# Altium schematic sheet Conn_B.SchDoc
size A1
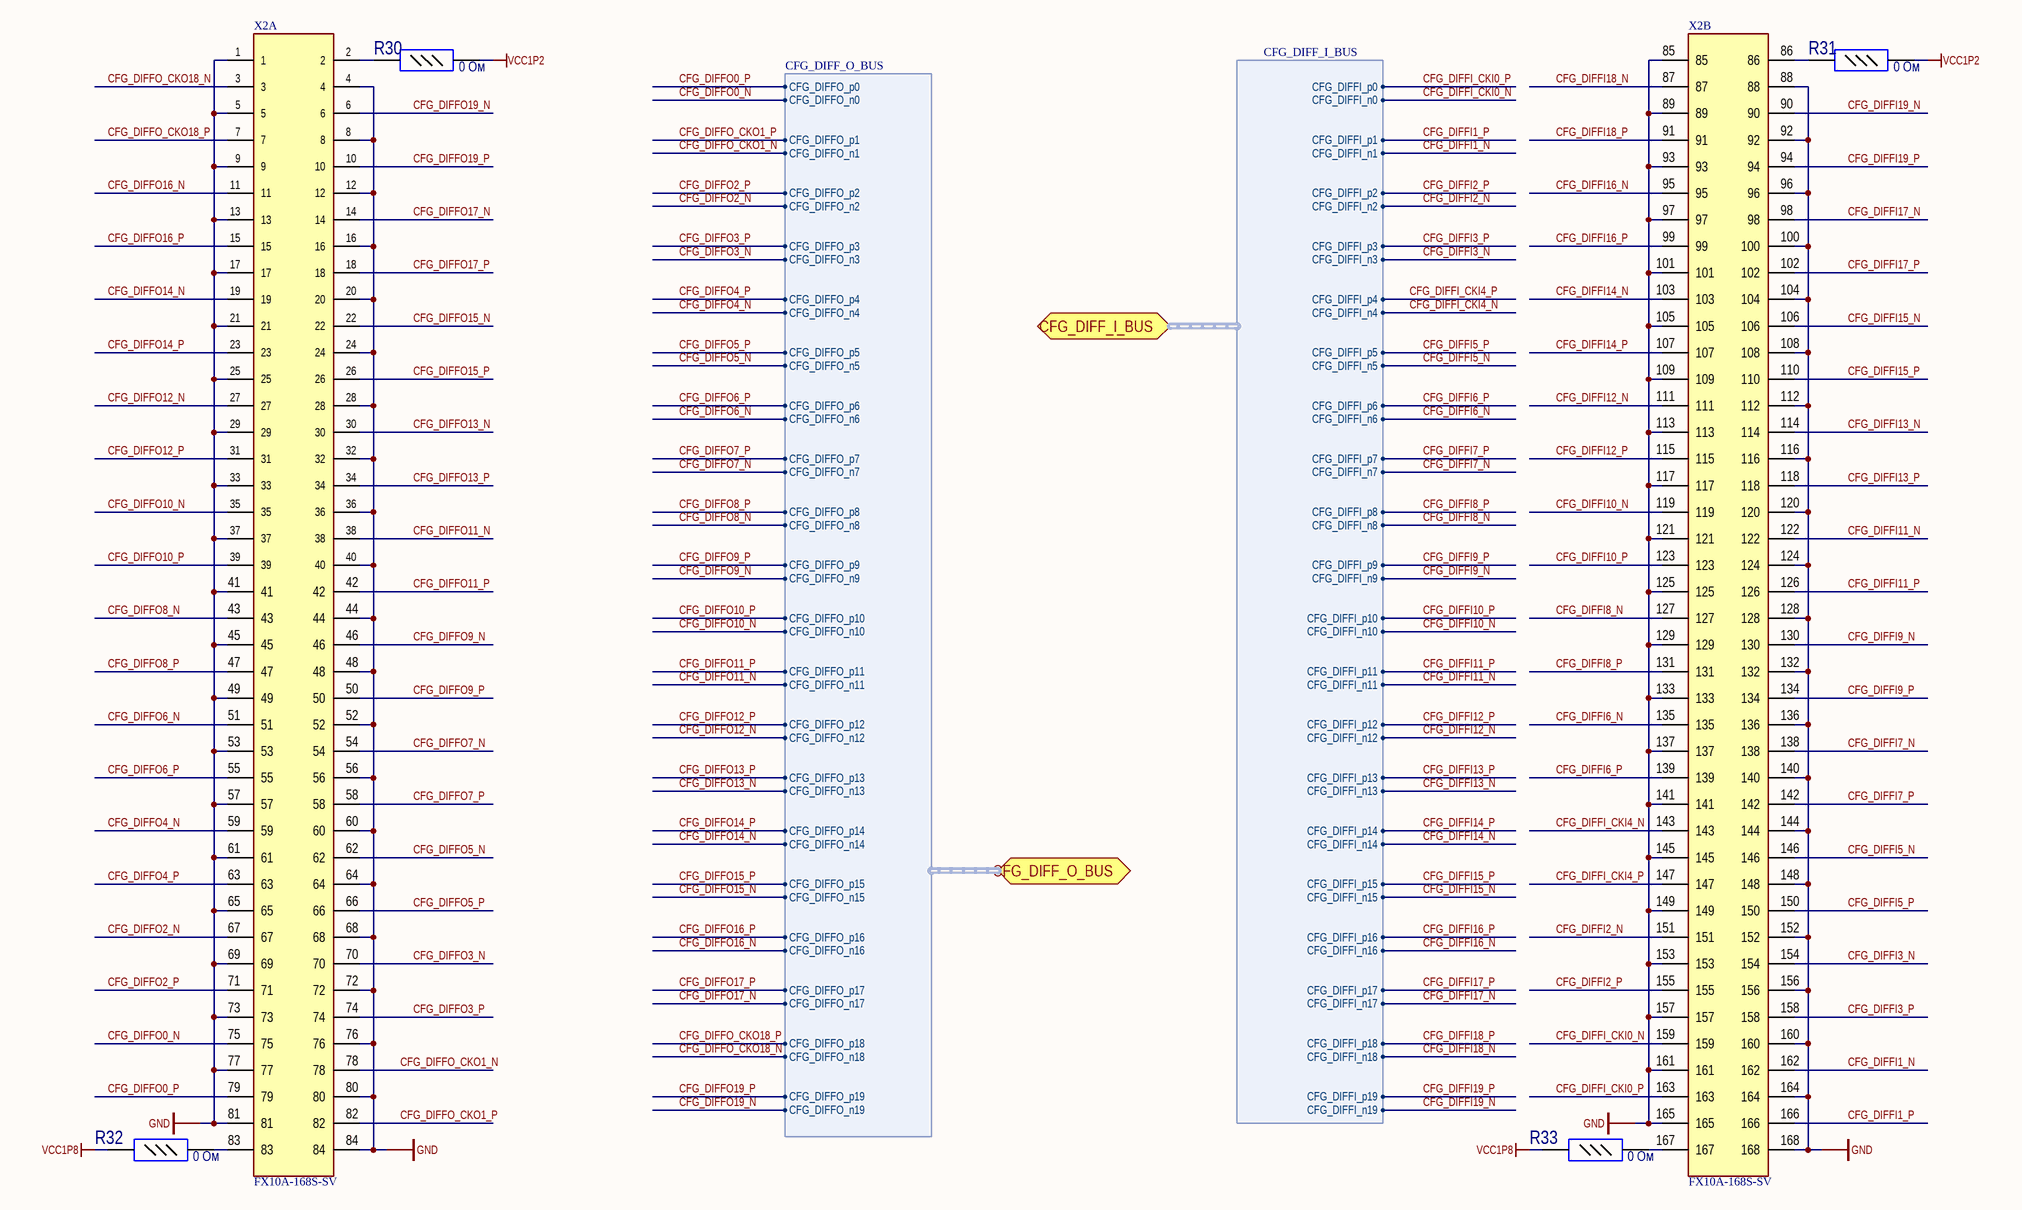
[diagram p0: Conn_B.SchDoc]

## Parts
R30  value 0 Ом  [CR0603]  (hidden comment: CR0603-0 Ом-±5%)
R31  value 0 Ом  [CR0603]  (hidden comment: CR0603-0 Ом-±5%)
R32  value 0 Ом  [CR0603]  (hidden comment: CR0603-0 Ом-±5%)
R33  value 0 Ом  [CR0603]  (hidden comment: CR0603-0 Ом-±5%)
X2  FX10A-168S-SV  [FX10A-168S-SV]  (parts A,B of 2)

## Ports
CFG_DIFF_I_BUS (harness CFG_DIFF_I_BUS), CFG_DIFF_O_BUS (harness CFG_DIFF_O_BUS)

## Harnesses
CFG_DIFF_I_BUS: CFG_DIFFI_p0, CFG_DIFFI_p1, CFG_DIFFI_p2, CFG_DIFFI_p3, CFG_DIFFI_p4, CFG_DIFFI_p5, CFG_DIFFI_p6, CFG_DIFFI_p7, CFG_DIFFI_p8, CFG_DIFFI_p9, CFG_DIFFI_p10, CFG_DIFFI_p11, CFG_DIFFI_p12, CFG_DIFFI_p13, CFG_DIFFI_p14, CFG_DIFFI_p15, CFG_DIFFI_p16, CFG_DIFFI_p17, CFG_DIFFI_p18, CFG_DIFFI_p19, CFG_DIFFI_n0, CFG_DIFFI_n1, CFG_DIFFI_n2, CFG_DIFFI_n3, CFG_DIFFI_n4, CFG_DIFFI_n5, CFG_DIFFI_n6, CFG_DIFFI_n7, CFG_DIFFI_n8, CFG_DIFFI_n9, CFG_DIFFI_n10, CFG_DIFFI_n11, CFG_DIFFI_n12, CFG_DIFFI_n13, CFG_DIFFI_n14, CFG_DIFFI_n15, CFG_DIFFI_n16, CFG_DIFFI_n17, CFG_DIFFI_n18, CFG_DIFFI_n19
CFG_DIFF_O_BUS: CFG_DIFFO_p0, CFG_DIFFO_n0, CFG_DIFFO_p1, CFG_DIFFO_p2, CFG_DIFFO_p3, CFG_DIFFO_p4, CFG_DIFFO_p5, CFG_DIFFO_p6, CFG_DIFFO_p7, CFG_DIFFO_p8, CFG_DIFFO_p9, CFG_DIFFO_p10, CFG_DIFFO_p11, CFG_DIFFO_p12, CFG_DIFFO_p13, CFG_DIFFO_p14, CFG_DIFFO_p15, CFG_DIFFO_p16, CFG_DIFFO_p17, CFG_DIFFO_p18, CFG_DIFFO_p19, CFG_DIFFO_n1, CFG_DIFFO_n2, CFG_DIFFO_n3, CFG_DIFFO_n4, CFG_DIFFO_n5, CFG_DIFFO_n6, CFG_DIFFO_n7, CFG_DIFFO_n8, CFG_DIFFO_n9, CFG_DIFFO_n10, CFG_DIFFO_n11, CFG_DIFFO_n12, CFG_DIFFO_n13, CFG_DIFFO_n14, CFG_DIFFO_n15, CFG_DIFFO_n16, CFG_DIFFO_n17, CFG_DIFFO_n18, CFG_DIFFO_n19

## Nets
GND: X2.1 X2.4 X2.5 X2.8 X2.9 X2.12 X2.13 X2.16 X2.17 X2.20 X2.21 X2.24 X2.25 X2.28 X2.29 X2.32 X2.33 X2.36 X2.37 X2.40 X2.41 X2.44 X2.45 X2.48 X2.49 X2.52 X2.53 X2.56 X2.57 X2.60 X2.61 X2.64 X2.65 X2.68 X2.69 X2.72 X2.73 X2.76 X2.77 X2.80 X2.81 X2.84 X2.85 X2.88 X2.89 X2.92 X2.93 X2.96 X2.97 X2.100 X2.101 X2.104 X2.105 X2.108 X2.109 X2.112 X2.113 X2.116 X2.117 X2.120 X2.121 X2.124 X2.125 X2.128 X2.129 X2.132 X2.133 X2.136 X2.137 X2.140 X2.141 X2.144 X2.145 X2.148 X2.149 X2.152 X2.153 X2.156 X2.157 X2.160 X2.161 X2.164 X2.165 X2.168
VCC1P2: R30.2(-) R31.2(-)
VCC1P8: R32.1(+) R33.1(+)
CFG_DIFFI1_N: X2.162 ; port CFG_DIFF_I_BUS.CFG_DIFFI_n1
CFG_DIFFI1_P: X2.166 ; port CFG_DIFF_I_BUS.CFG_DIFFI_p1
CFG_DIFFI2_N: X2.151 ; port CFG_DIFF_I_BUS.CFG_DIFFI_n2
CFG_DIFFI2_P: X2.155 ; port CFG_DIFF_I_BUS.CFG_DIFFI_p2
CFG_DIFFI3_N: X2.154 ; port CFG_DIFF_I_BUS.CFG_DIFFI_n3
CFG_DIFFI3_P: X2.158 ; port CFG_DIFF_I_BUS.CFG_DIFFI_p3
CFG_DIFFI5_N: X2.146 ; port CFG_DIFF_I_BUS.CFG_DIFFI_n5
CFG_DIFFI5_P: X2.150 ; port CFG_DIFF_I_BUS.CFG_DIFFI_p5
CFG_DIFFI6_N: X2.135 ; port CFG_DIFF_I_BUS.CFG_DIFFI_n6
CFG_DIFFI6_P: X2.139 ; port CFG_DIFF_I_BUS.CFG_DIFFI_p6
CFG_DIFFI7_N: X2.138 ; port CFG_DIFF_I_BUS.CFG_DIFFI_n7
CFG_DIFFI7_P: X2.142 ; port CFG_DIFF_I_BUS.CFG_DIFFI_p7
CFG_DIFFI8_N: X2.127 ; port CFG_DIFF_I_BUS.CFG_DIFFI_n8
CFG_DIFFI8_P: X2.131 ; port CFG_DIFF_I_BUS.CFG_DIFFI_p8
CFG_DIFFI9_N: X2.130 ; port CFG_DIFF_I_BUS.CFG_DIFFI_n9
CFG_DIFFI9_P: X2.134 ; port CFG_DIFF_I_BUS.CFG_DIFFI_p9
CFG_DIFFI10_N: X2.119 ; port CFG_DIFF_I_BUS.CFG_DIFFI_n10
CFG_DIFFI10_P: X2.123 ; port CFG_DIFF_I_BUS.CFG_DIFFI_p10
CFG_DIFFI11_N: X2.122 ; port CFG_DIFF_I_BUS.CFG_DIFFI_n11
CFG_DIFFI11_P: X2.126 ; port CFG_DIFF_I_BUS.CFG_DIFFI_p11
CFG_DIFFI12_N: X2.111 ; port CFG_DIFF_I_BUS.CFG_DIFFI_n12
CFG_DIFFI12_P: X2.115 ; port CFG_DIFF_I_BUS.CFG_DIFFI_p12
CFG_DIFFI13_N: X2.114 ; port CFG_DIFF_I_BUS.CFG_DIFFI_n13
CFG_DIFFI13_P: X2.118 ; port CFG_DIFF_I_BUS.CFG_DIFFI_p13
CFG_DIFFI14_N: X2.103 ; port CFG_DIFF_I_BUS.CFG_DIFFI_n14
CFG_DIFFI14_P: X2.107 ; port CFG_DIFF_I_BUS.CFG_DIFFI_p14
CFG_DIFFI15_N: X2.106 ; port CFG_DIFF_I_BUS.CFG_DIFFI_n15
CFG_DIFFI15_P: X2.110 ; port CFG_DIFF_I_BUS.CFG_DIFFI_p15
CFG_DIFFI16_N: X2.95 ; port CFG_DIFF_I_BUS.CFG_DIFFI_n16
CFG_DIFFI16_P: X2.99 ; port CFG_DIFF_I_BUS.CFG_DIFFI_p16
CFG_DIFFI17_N: X2.98 ; port CFG_DIFF_I_BUS.CFG_DIFFI_n17
CFG_DIFFI17_P: X2.102 ; port CFG_DIFF_I_BUS.CFG_DIFFI_p17
CFG_DIFFI18_N: X2.87 ; port CFG_DIFF_I_BUS.CFG_DIFFI_n18
CFG_DIFFI18_P: X2.91 ; port CFG_DIFF_I_BUS.CFG_DIFFI_p18
CFG_DIFFI19_N: X2.90 ; port CFG_DIFF_I_BUS.CFG_DIFFI_n19
CFG_DIFFI19_P: X2.94 ; port CFG_DIFF_I_BUS.CFG_DIFFI_p19
CFG_DIFFI_CKI0_N: X2.159 ; port CFG_DIFF_I_BUS.CFG_DIFFI_n0
CFG_DIFFI_CKI0_P: X2.163 ; port CFG_DIFF_I_BUS.CFG_DIFFI_p0
CFG_DIFFI_CKI4_N: X2.143 ; port CFG_DIFF_I_BUS.CFG_DIFFI_n4
CFG_DIFFI_CKI4_P: X2.147 ; port CFG_DIFF_I_BUS.CFG_DIFFI_p4
CFG_DIFFO0_N: X2.75 ; port CFG_DIFF_O_BUS.CFG_DIFFO_n0
CFG_DIFFO0_P: X2.79 ; port CFG_DIFF_O_BUS.CFG_DIFFO_p0
CFG_DIFFO2_N: X2.67 ; port CFG_DIFF_O_BUS.CFG_DIFFO_n2
CFG_DIFFO2_P: X2.71 ; port CFG_DIFF_O_BUS.CFG_DIFFO_p2
CFG_DIFFO3_N: X2.70 ; port CFG_DIFF_O_BUS.CFG_DIFFO_n3
CFG_DIFFO3_P: X2.74 ; port CFG_DIFF_O_BUS.CFG_DIFFO_p3
CFG_DIFFO4_N: X2.59 ; port CFG_DIFF_O_BUS.CFG_DIFFO_n4
CFG_DIFFO4_P: X2.63 ; port CFG_DIFF_O_BUS.CFG_DIFFO_p4
CFG_DIFFO5_N: X2.62 ; port CFG_DIFF_O_BUS.CFG_DIFFO_n5
CFG_DIFFO5_P: X2.66 ; port CFG_DIFF_O_BUS.CFG_DIFFO_p5
CFG_DIFFO6_N: X2.51 ; port CFG_DIFF_O_BUS.CFG_DIFFO_n6
CFG_DIFFO6_P: X2.55 ; port CFG_DIFF_O_BUS.CFG_DIFFO_p6
CFG_DIFFO7_N: X2.54 ; port CFG_DIFF_O_BUS.CFG_DIFFO_n7
CFG_DIFFO7_P: X2.58 ; port CFG_DIFF_O_BUS.CFG_DIFFO_p7
CFG_DIFFO8_N: X2.43 ; port CFG_DIFF_O_BUS.CFG_DIFFO_n8
CFG_DIFFO8_P: X2.47 ; port CFG_DIFF_O_BUS.CFG_DIFFO_p8
CFG_DIFFO9_N: X2.46 ; port CFG_DIFF_O_BUS.CFG_DIFFO_n9
CFG_DIFFO9_P: X2.50 ; port CFG_DIFF_O_BUS.CFG_DIFFO_p9
CFG_DIFFO10_N: X2.35 ; port CFG_DIFF_O_BUS.CFG_DIFFO_n10
CFG_DIFFO10_P: X2.39 ; port CFG_DIFF_O_BUS.CFG_DIFFO_p10
CFG_DIFFO11_N: X2.38 ; port CFG_DIFF_O_BUS.CFG_DIFFO_n11
CFG_DIFFO11_P: X2.42 ; port CFG_DIFF_O_BUS.CFG_DIFFO_p11
CFG_DIFFO12_N: X2.27 ; port CFG_DIFF_O_BUS.CFG_DIFFO_n12
CFG_DIFFO12_P: X2.31 ; port CFG_DIFF_O_BUS.CFG_DIFFO_p12
CFG_DIFFO13_N: X2.30 ; port CFG_DIFF_O_BUS.CFG_DIFFO_n13
CFG_DIFFO13_P: X2.34 ; port CFG_DIFF_O_BUS.CFG_DIFFO_p13
CFG_DIFFO14_N: X2.19 ; port CFG_DIFF_O_BUS.CFG_DIFFO_n14
CFG_DIFFO14_P: X2.23 ; port CFG_DIFF_O_BUS.CFG_DIFFO_p14
CFG_DIFFO15_N: X2.22 ; port CFG_DIFF_O_BUS.CFG_DIFFO_n15
CFG_DIFFO15_P: X2.26 ; port CFG_DIFF_O_BUS.CFG_DIFFO_p15
CFG_DIFFO16_N: X2.11 ; port CFG_DIFF_O_BUS.CFG_DIFFO_n16
CFG_DIFFO16_P: X2.15 ; port CFG_DIFF_O_BUS.CFG_DIFFO_p16
CFG_DIFFO17_N: X2.14 ; port CFG_DIFF_O_BUS.CFG_DIFFO_n17
CFG_DIFFO17_P: X2.18 ; port CFG_DIFF_O_BUS.CFG_DIFFO_p17
CFG_DIFFO19_N: X2.6 ; port CFG_DIFF_O_BUS.CFG_DIFFO_n19
CFG_DIFFO19_P: X2.10 ; port CFG_DIFF_O_BUS.CFG_DIFFO_p19
CFG_DIFFO_CKO1_N: X2.78 ; port CFG_DIFF_O_BUS.CFG_DIFFO_n1
CFG_DIFFO_CKO1_P: X2.82 ; port CFG_DIFF_O_BUS.CFG_DIFFO_p1
CFG_DIFFO_CKO18_N: X2.3 ; port CFG_DIFF_O_BUS.CFG_DIFFO_n18
CFG_DIFFO_CKO18_P: X2.7 ; port CFG_DIFF_O_BUS.CFG_DIFFO_p18
NetR30_1: R30.1(+) X2.2
NetR31_1: R31.1(+) X2.86
NetR32_2: R32.2(-) X2.83
NetR33_2: R33.2(-) X2.167

## Library data of the parts
R30-R33 = CR0603-#-±5%: Чип резистор